# EAGLE design 3hub (EAGLE 6.1)
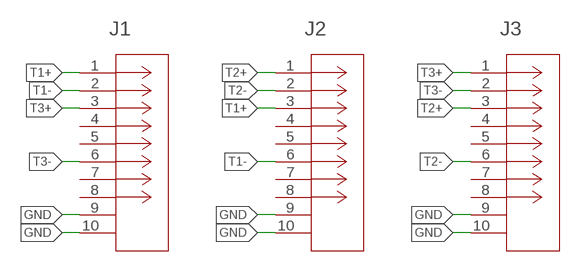
[diagram p0: schematic, sheet 1]

## Parts
J1  1-406541-1  [CONN8_406541_TEC]
J2  1-406541-1  [CONN8_406541_TEC]
J3  1-406541-1  [CONN8_406541_TEC]

## Nets
GND: J1.9 J1.10 J2.9 J2.10 J3.9 J3.10
T1+: J1.1 J2.3
T1-: J1.2 J2.6
T2+: J2.1 J3.3
T2-: J2.2 J3.6
T3+: J1.3 J3.1
T3-: J1.6 J3.2
Unconnected: J1.4 J1.5 J1.7 J1.8 J2.4 J2.5 J2.7 J2.8 J3.4 J3.5 J3.7 J3.8

## Library data of the parts
J1-J3 = rhoban:1-406541-1; COPYRIGHT: Copyright (C) 2021 Ultra Librarian. All rights reserved.; MANUFACTURER_PART_NUMBER: 1-406541-1; MFR_NAME: TE Connectivity; TYPE: Jack

## Net classes
0 default: width 0.381 mm

## Board
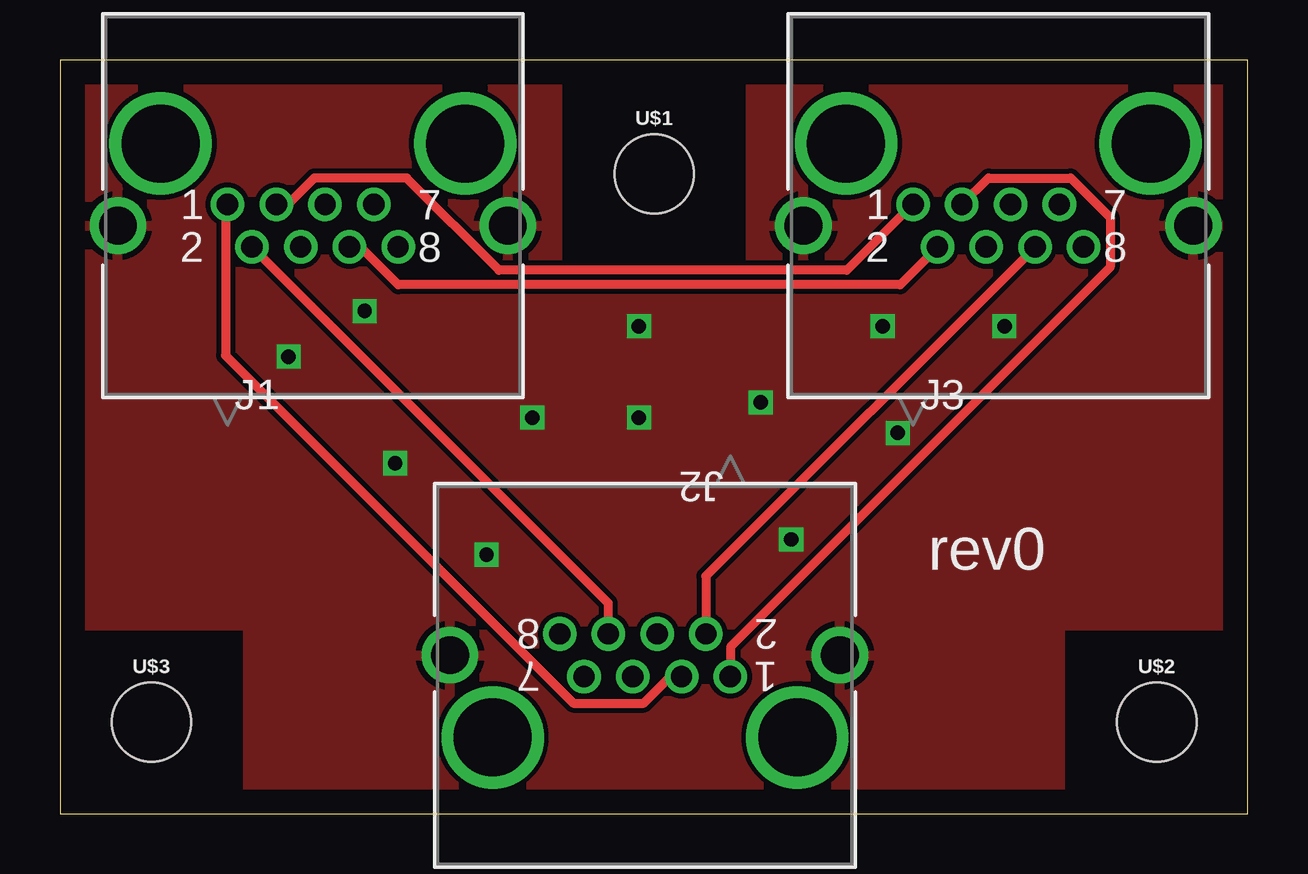
[diagram p1: board, top side]
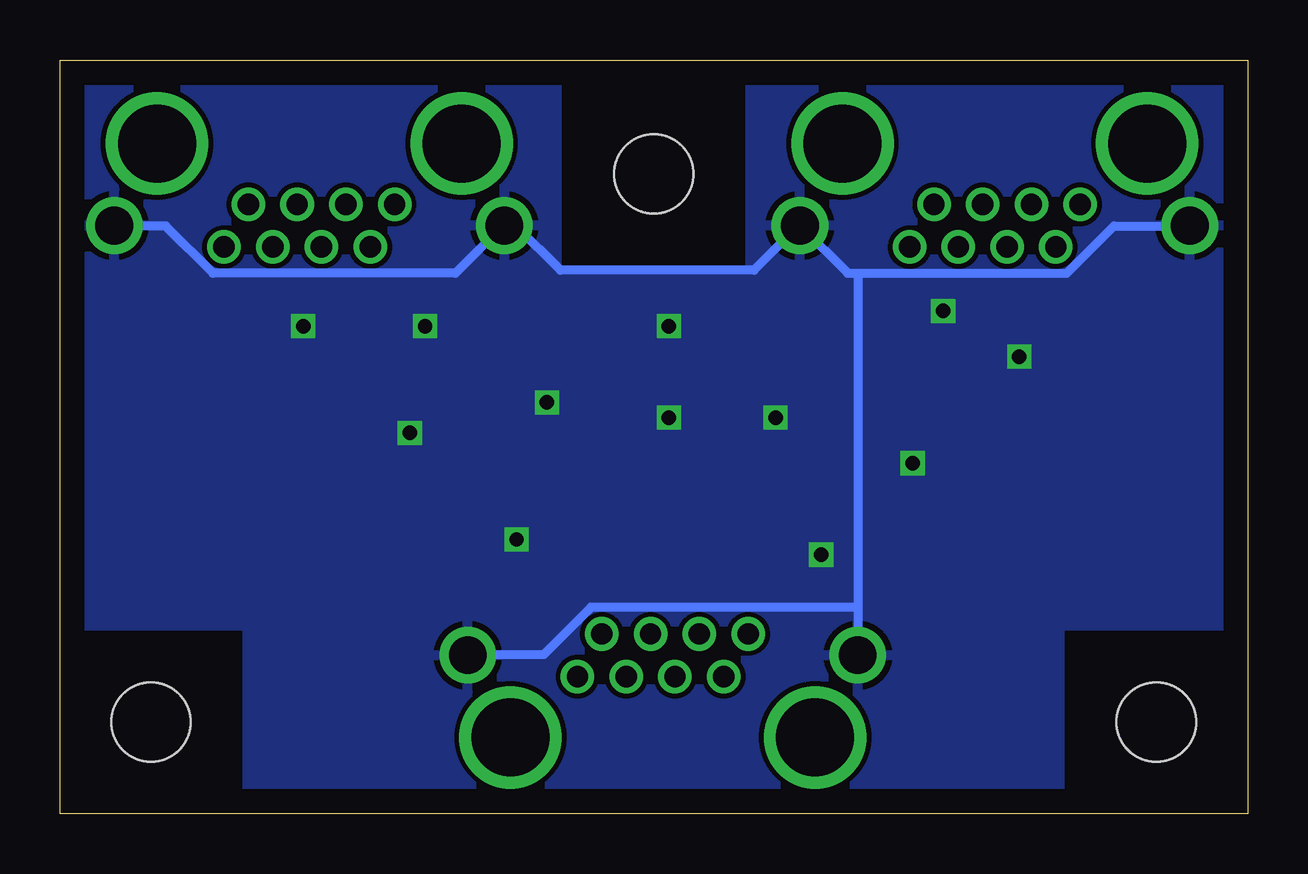
[diagram p2: board, bottom side, seen from below]

Size 49.51 x 31.42 mm. Coordinates in mm from the lower left corner, seen from the top.
Outline: 0,0 49.51,0 49.51,31.42 0,31.42 0,0
Copper layers (1*16): Top 0.035mm / dielectric 1.5mm / Bottom 0.035mm
Design rules: minimum track width 10mil, minimum drill 24mil, track to track 8mil, track to pad 8mil, pad to pad 8mil, via to via 8mil, smd to smd 8mil, copper to edge 40mil, drill to drill 8mil, minimum pad ring 10mil, minimum via ring 8mil, stop-mask expansion 4mil, vias tented up to drill 0mil, thermal gap 10mil
tRestrict: area 41.9,0 to 49.5,7.6; area 0,0 to 7.6,7.6; area 21,22.9 to 28.6,30.5
bRestrict: area 41.9,0 to 49.5,7.6; area 0,0 to 7.6,7.6; area 21,22.9 to 28.6,30.5

### Footprints (pad centres in the part's own frame; a part is rotated, then mirrored left to right if it is on the bottom)
CONN8_406541_TEC = drill 0.889 pad 1.397: 1 0,0; 2 1.016,-1.778; 3 2.032,0; 4 3.048,-1.778; 5 4.064,0; 6 5.08,-1.778; 7 6.096,0; 8 7.112,-1.778 | drill 1.575 pad 2.083: 9 -4.572,-0.889; 10 11.684,-0.889 | drill 3.251 pad 3.251: 11 -2.794,2.54; 12 9.906,2.54
STAND-OFF = hole 3.302: 0,0

### Placement (x,y rotation side)
J1  6.99,25.4 0 top
J2  27.94,5.71 180 top
J3  35.56,25.4 0 top
U$1  [STAND-OFF]  24.77,26.67 0 top
U$2  [STAND-OFF]  45.72,3.81 0 top
U$3  [STAND-OFF]  3.81,3.81 0 top

### Tracks (layer width: path | path; a pad name or v marks a point on that pad's centre or on a via)
GND  (via drill 0.6)
  Bottom 0.381: 16.25,22.52 16.68,22.52 18.65,24.5 J1.10 18.82,24.4 20.57,22.65 28.65,22.65 30.5,24.5 30.98,24.5 J3.9 31.15,24.4 33.02,22.52 43.12,22.52 45.1,24.5 47.23,24.5 J3.10 | 16.25,22.52 7.55,22.52 5.58,24.5 2.42,24.5 J1.9 | 16.25,22.52 16.25,8.6 | 16.25,8.6 16.25,6.62 J2.10 | 16.25,8.6 27.38,8.6 29.35,6.62 32.5,6.62 J2.9
  other vias: 9.53,19.05 13.97,14.61 17.78,10.79 12.7,20.95 19.68,16.51 24.13,16.51 24.13,20.32 29.21,17.14 34.29,20.32 39.37,20.32 34.92,15.88 30.48,11.43
  pour Bottom: -1.91,40.01 59.05,40.01 59.05,-6.99 -8.26,-6.99 -8.26,22.23
  pour Top: -3.81,38.73 57.15,38.73 57.15,-5.08 -9.53,-5.08 -9.53,25.4
T1+
  Top 0.381: J2.3 25.43,5.7 24.32,4.6 21.4,4.6 6.9,19.1 6.9,25.32 6.97,25.4 J1.1
T1-
  Top 0.381: J2.6 22.85,8.78 8.03,23.6 J1.2
T2+
  Top 0.381: J2.1 27.95,5.72 27.95,6.95 43.77,22.77 43.77,24.85 42.12,26.5 38.7,26.5 J3.3
T2-
  Top 0.381: J2.2 26.93,9.9 40.62,23.6 J3.6
T3+
  Top 0.381: J1.3 9.5,25.4 10.6,26.5 14.45,26.5 18.3,22.65 32.8,22.65 J3.1
T3-
  Top 0.381: J1.6 12.07,23.6 12.55,23.6 14.1,22.05 35.02,22.05 36.58,23.6 J3.2

### Text on the board
tPlace: rev0